# Altium schematic sheet MCISO-S08-V00-HallDifferentials.SchDoc
size A4; SheetNumber: 3; SheetTotal: 6
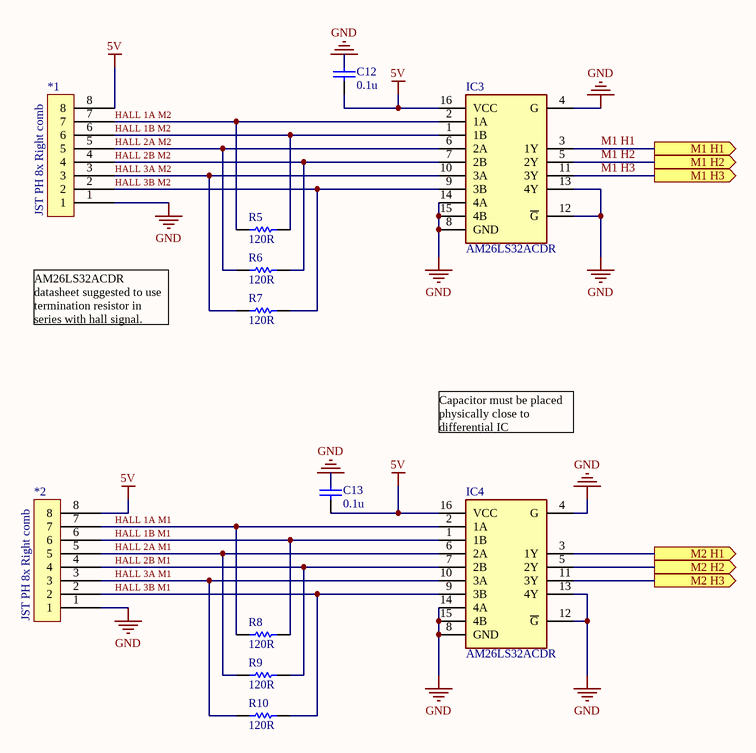
[diagram p0: MCISO-S08-V00-HallDifferentials.SchDoc]

## Parts
*1  JST PH 8x Right comb  [JST PH 8x RIGHT SMD]
*2  JST PH 8x Right comb  [JST PH 8x RIGHT SMD]
C12  0.1u  [Cap_Ceramic_0603]
C13  0.1u  [Cap_Ceramic_0603]
IC3  AM26LS32ACDR  [SOIC127P600X175-16N]
IC4  AM26LS32ACDR  [SOIC127P600X175-16N]
R5  120R  [Res_ThinFilm_1210]
R6  120R  [Res_ThinFilm_1210]
R7  120R  [Res_ThinFilm_1210]
R8  120R  [Res_ThinFilm_1210]
R9  120R  [Res_ThinFilm_1210]
R10  120R  [Res_ThinFilm_1210]

## Ports
M1 H1 (out), M1 H2 (out), M1 H3 (out), M2 H1 (out), M2 H2 (out), M2 H3 (out)

## Nets
5V: *1.8 *2.8 C12.2 C13.2 IC3.16(VCC) IC4.16(VCC)
GND: *1.1 *2.1 C12.1 C13.1 IC3.4(G) IC3.8(GND) IC3.12(~{G}) IC3.13(4Y) IC3.14(4A) IC3.15(4B) IC4.4(G) IC4.8(GND) IC4.12(~{G}) IC4.13(4Y) IC4.14(4A) IC4.15(4B)
HALL 1A M1: *2.7 IC4.2(1A) R8.1
HALL 1A M2: *1.7 IC3.2(1A) R5.1
HALL 1B M1: *2.6 IC4.1(1B) R8.2
HALL 1B M2: *1.6 IC3.1(1B) R5.2
HALL 2A M1: *2.5 IC4.6(2A) R9.1
HALL 2A M2: *1.5 IC3.6(2A) R6.1
HALL 2B M1: *2.4 IC4.7(2B) R9.2
HALL 2B M2: *1.4 IC3.7(2B) R6.2
HALL 3A M1: *2.3 IC4.10(3A) R10.1
HALL 3A M2: *1.3 IC3.10(3A) R7.1
HALL 3B M1: *2.2 IC4.9(3B) R10.2
HALL 3B M2: *1.2 IC3.9(3B) R7.2
M1 H1: IC3.3(1Y) ; port M1 H1
M1 H2: IC3.5(2Y) ; port M1 H2
M1 H3: IC3.11(3Y) ; port M1 H3
M2 H1: IC4.3(1Y) ; port M2 H1
M2 H2: IC4.5(2Y) ; port M2 H2
M2 H3: IC4.11(3Y) ; port M2 H3

## Notes on the sheet
- AM26LS32ACDR datasheet suggested to use termination resistor in series with hall signal.
- Capacitor must be placed physically close to differential IC

## Library data of the parts
C12 C13 = 4u7 50V 5% X7R 0603: Capacitor, Ceramic, SMD, 4u7, 50V, 5%, X7R, 0603
IC3 IC4 = AM26LS32ACDR: Integrated Circuit; Manufacturer_Name: Texas Instruments; Datasheet Link: http://www.ti.com/lit/gpn/am26ls32ac; Height: 1.75mm; Manufacturer_Part_Number: AM26LS32ACDR; Mouser Part Number: 595-AM26LS32ACDR; Mouser Price/Stock: https://www.mouser.co.uk/ProductDetail/Texas-Instruments/AM26LS32ACDR/?qs=L4Mc90zKIpjEhSPPcfdoEw%3D%3D; Arrow Part Number: AM26LS32ACDR; Arrow Price/Stock: https://www.arrow.com/en/products/am26ls32acdr/texas-instruments
R5-R10 = 120R 1% 1210: Resistor, SMD, 120R, 0.25W, 1%, 1210